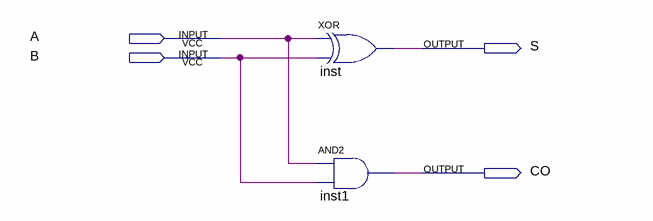
[diagram p0: schematic sheet]
// Quartus schematic Half_Adder.bdf as structural Verilog: 2 symbols, 4 pins
module Half_Adder (
  input  A,
  input  B,
  output S,
  output CO
);

  xor inst (S, A, B);
  and inst1 (CO, A, B);
endmodule
